# EasyEDA Pro project 硬件_幅度分档控制.epro

# Schematic Schematic1
Board Name: Board1; Create Date: 2025-05-23; Page Name: P1; Project Name: 硬件课设new; Schematic Name: Schematic1; Update Date: 2025-06-08; Company: 嘉立创EDA; Page Size: A4; Version: V1.0
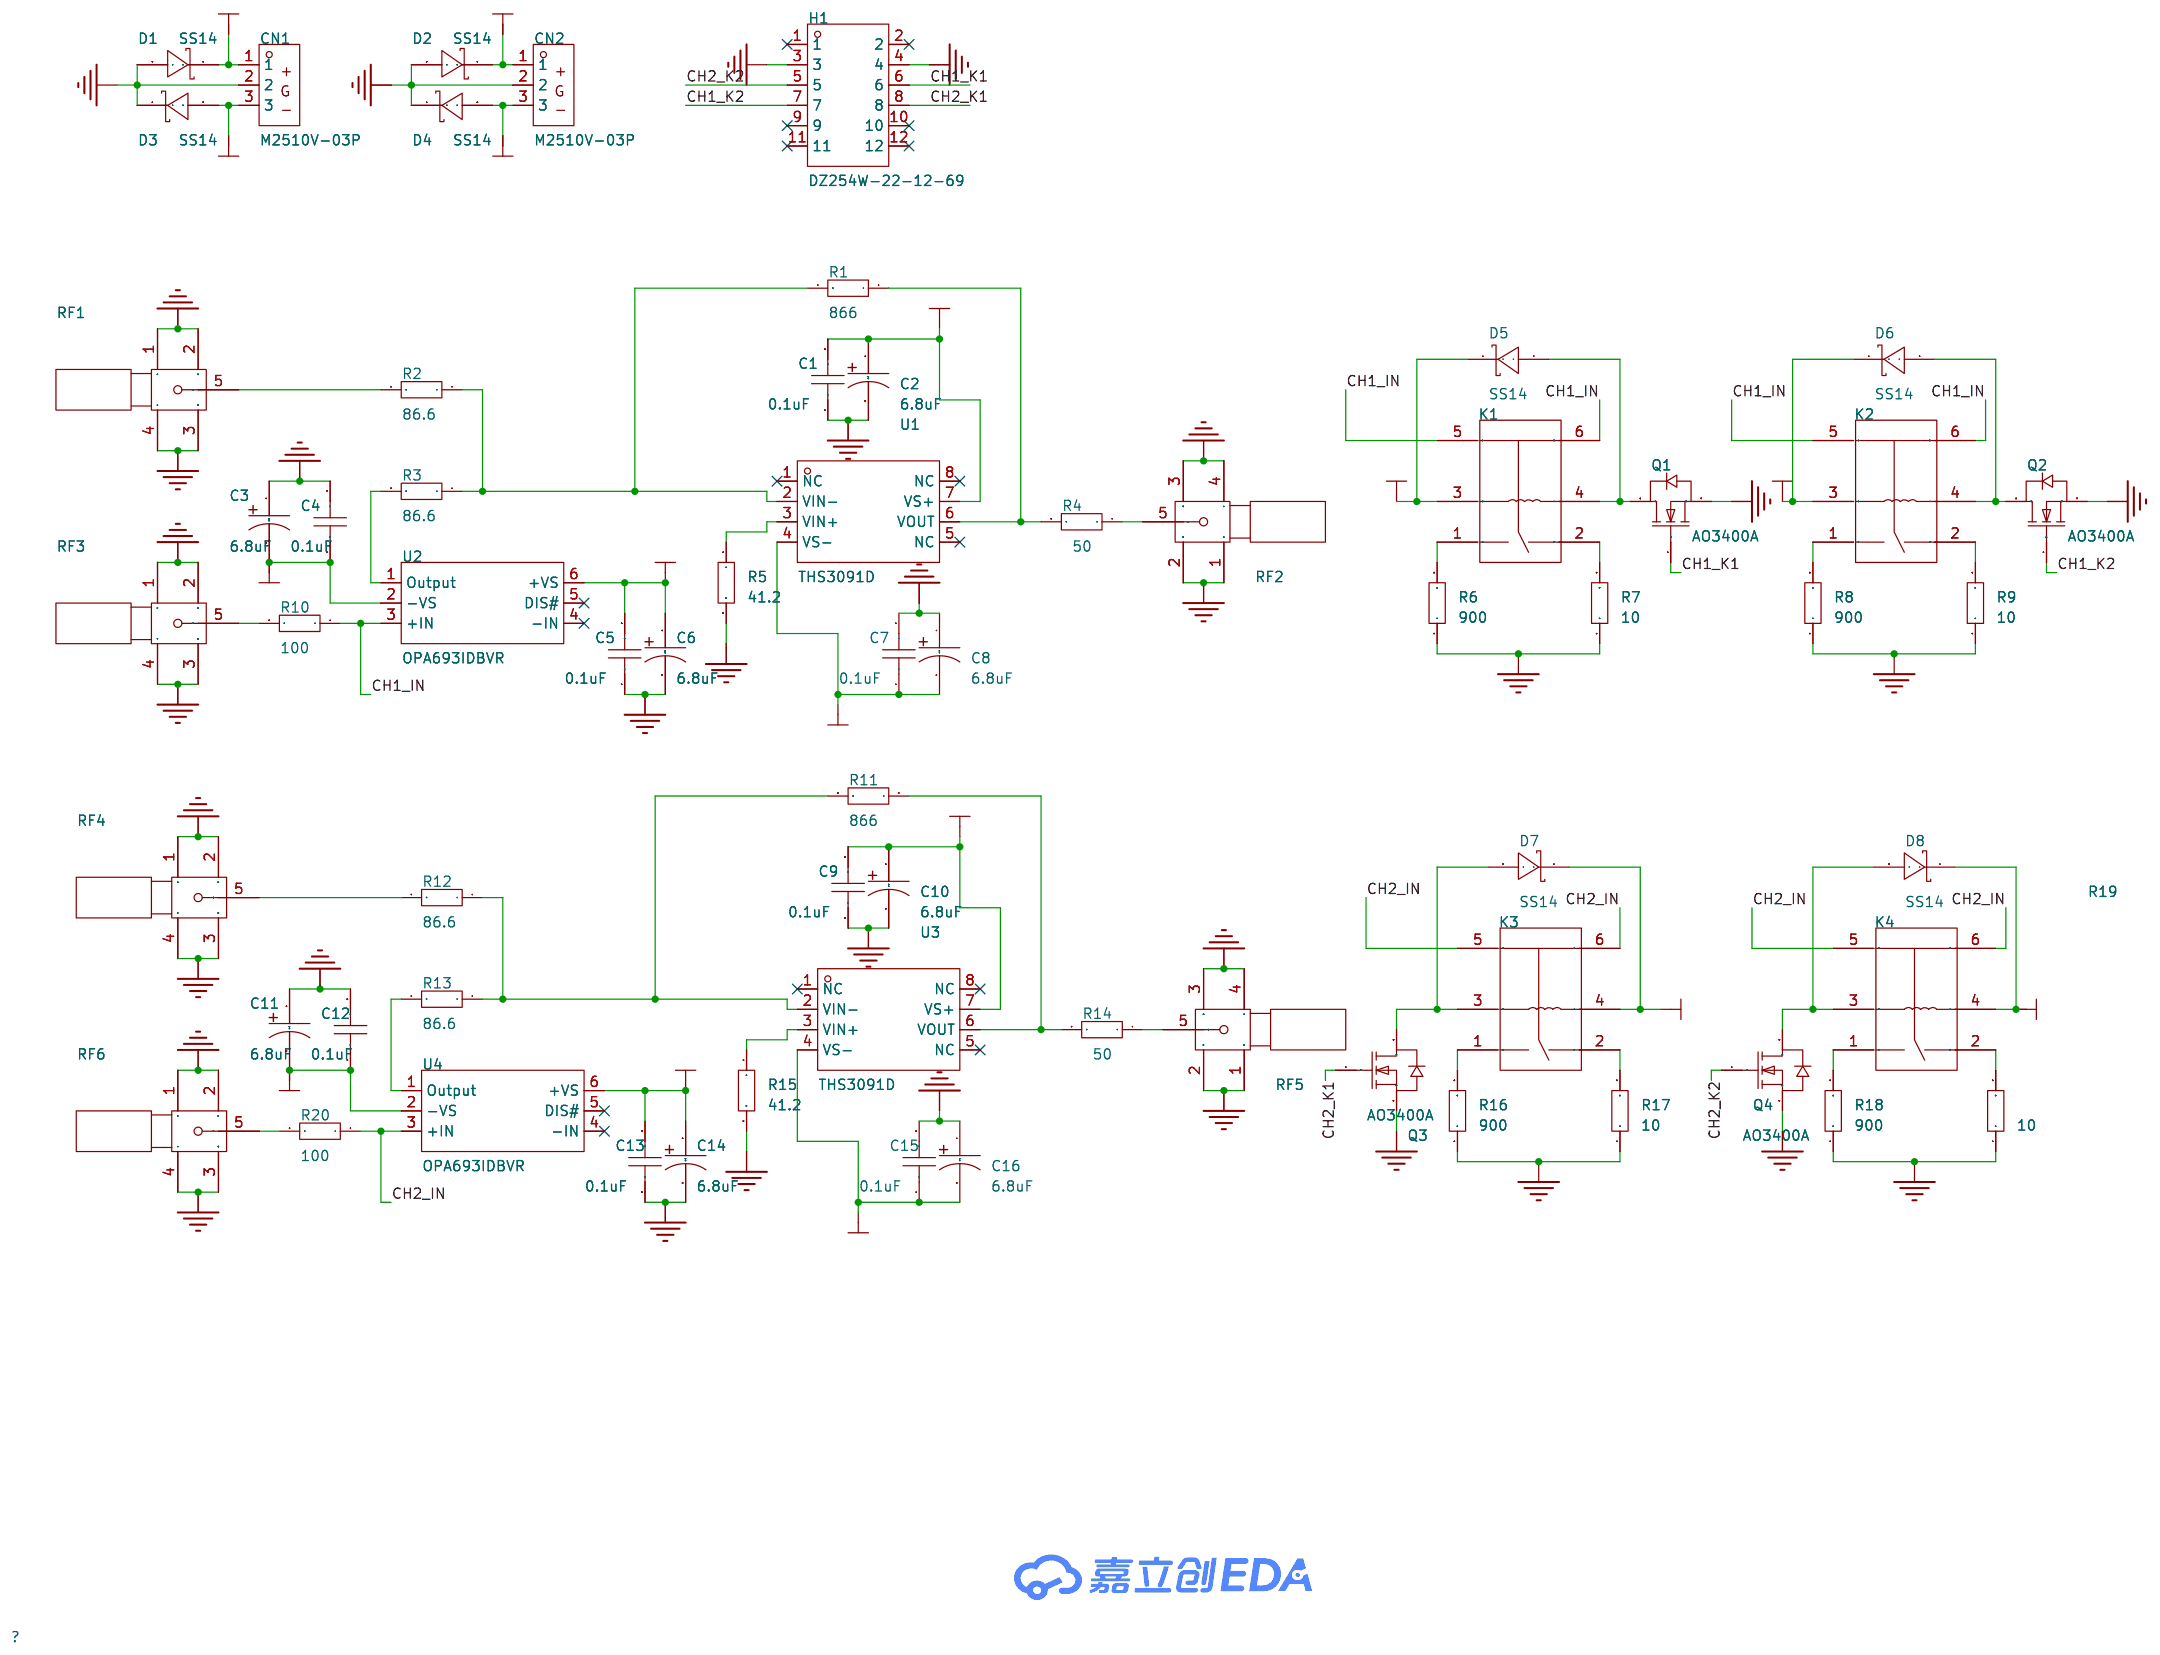
[diagram p0: schematic sheet]

## Parts
C1  0.1uF  [C0603_N]
C2  6.8uF  [CAP-SMD_L6.0-W3.2]
C3  6.8uF  [CAP-SMD_L6.0-W3.2]
C4  0.1uF  [C0603_N]
C5  0.1uF  [C0603_N]
C6  6.8uF  [CAP-SMD_L6.0-W3.2]
C7  0.1uF  [C0603_N]
C8  6.8uF  [CAP-SMD_L6.0-W3.2]
C9  0.1uF  [C0603_N]
C10  6.8uF  [CAP-SMD_L6.0-W3.2]
C11  6.8uF  [CAP-SMD_L6.0-W3.2]
C12  0.1uF  [C0603_N]
C13  0.1uF  [C0603_N]
C14  6.8uF  [CAP-SMD_L6.0-W3.2]
C15  0.1uF  [C0603_N]
C16  6.8uF  [CAP-SMD_L6.0-W3.2]
CN1  M2510V-03P  [CONN-TH_M2510V-03P]
CN2  M2510V-03P  [CONN-TH_M2510V-03P]
D1  SS14  [SMA_L4.3-W2.6-LS5.2-RD]
D2  SS14  [SMA_L4.3-W2.6-LS5.2-RD]
D3  SS14  [SMA_L4.3-W2.6-LS5.2-RD]
D4  SS14  [SMA_L4.3-W2.6-LS5.2-RD]
D5  SS14  [SMA_L4.3-W2.6-LS5.2-RD]
D6  SS14  [SMA_L4.3-W2.6-LS5.2-RD]
D7  SS14  [SMA_L4.3-W2.6-LS5.2-RD]
D8  SS14  [SMA_L4.3-W2.6-LS5.2-RD]
H1  DZ254W-22-12-69  [HDR-TH_12P-P2.54-H-M-R2-C6-S2.54-W12.5]
K1  HK4100F-DC5V-SHG  [RELAY-TH_HK4100F-DC5V-SHG]
K2  HK4100F-DC5V-SHG  [RELAY-TH_HK4100F-DC5V-SHG]
K3  HK4100F-DC5V-SHG  [RELAY-TH_HK4100F-DC5V-SHG]
K4  HK4100F-DC5V-SHG  [RELAY-TH_HK4100F-DC5V-SHG]
Q1  AO3400A  [SOT-23-3_L2.9-W1.3-P1.90-LS2.4-BR]
Q2  AO3400A  [SOT-23-3_L2.9-W1.3-P1.90-LS2.4-BR]
Q3  AO3400A  [SOT-23-3_L2.9-W1.3-P1.90-LS2.4-BR]
Q4  AO3400A  [SOT-23-3_L2.9-W1.3-P1.90-LS2.4-BR]
R1  866  [R0603_N]
R2  86.6  [R0603_N]
R3  86.6  [R0603_N]
R4  50  [R0603_N]
R5  41.2  [R0603_N]
R6  900  [R0603_N]
R7  10  [R0603_N]
R8  900  [R0603_N]
R9  10  [R0603_N]
R10  100  [R0603_N]
R11  866  [R0603_N]
R12  86.6  [R0603_N]
R13  86.6  [R0603_N]
R14  50  [R0603_N]
R15  41.2  [R0603_N]
R16  900  [R0603_N]
R17  10  [R0603_N]
R18  900  [R0603_N]
R19  10  [R0603_N]
R20  100  [R0603_N]
RF1  BWSMA-KE-P001  [SMA-SMD_BWSMA-KE-P001]
RF2  BWSMA-KE-P001  [SMA-SMD_BWSMA-KE-P001]
RF3  BWSMA-KE-P001  [SMA-SMD_BWSMA-KE-P001]
RF4  BWSMA-KE-P001  [SMA-SMD_BWSMA-KE-P001]
RF5  BWSMA-KE-P001  [SMA-SMD_BWSMA-KE-P001]
RF6  BWSMA-KE-P001  [SMA-SMD_BWSMA-KE-P001]
U1  THS3091D  [SOIC-8_L4.9-W3.9-P1.27-LS6.0-TR]
U2  OPA693IDBVR  [SOT-23-6_L2.9-W1.6-P0.95-LS2.8-BL]
U3  THS3091D  [SOIC-8_L4.9-W3.9-P1.27-LS6.0-TR]
U4  OPA693IDBVR  [SOT-23-6_L2.9-W1.6-P0.95-LS2.8-BL]

## Library data of the parts
C1 C4 C5 C7 C9 C12 C13 C15 = CAP_0805: Supplier Footprint: 0603
C2 C3 C6 C8 C10 C11 C14 C16 = TPSC685K035R0350: 容值:6.8uF;精度:±10%;额定电压:35V;等效串联电阻:350mΩ@100kHz;; LCSC Part Name: 6.8uF ±10% 35V; Supplier Part: C308928; Manufacturer: Kyocera AVX; Supplier Footprint: CASE-C-6032; JLCPCB Part Class: Extended Part; Datasheet: https://atta.szlcsc.com/upload/public/pdf/source/20181129/C308928_3E6DA6FC57C95F0966ACBCD944046350.pdf; Supplier: LCSC; Tolerance: ±10%; Rated Voltage: 35V; Equivalent Series Resistance(ESR): 350mΩ@100kHz; Operating Temperature: -55℃~+125℃
CN1 CN2 = M2510V-03P: 插针结构:1x3P;间距:2.54mm;安装方式:直插;参考系列:-;总PIN数:3P;排数:1;每排PIN数:3;行距:-;额定电流:3A;工作温度范围:-25℃~+85℃;; LCSC Part Name: 1x3P 间距:2.54mm 直插; Supplier Part: C2764791; Manufacturer: XFCN(兴飞); Supplier Footprint: 插件,P=2.54mm; JLCPCB Part Class: 扩展库; Datasheet: https://atta.szlcsc.com/upload/public/pdf/source/20210810/3DC46818253F58AEF0903D89F89BDDDF.pdf; Supplier: LCSC; Pins Structure: 1x3P; Pitch: 2.54mm; Mounting Style: 直插; Number of Pins: 3P; Number of Rows: 1; Number of PINs Per Row: 3; Current Rating (Max): 3A; Operating Temperature Range: -25℃~+85℃
D1-D8 = SS14_C83852: 正向压降(Vf):500mV@1A;直流反向耐压(Vr):40V;整流电流:1A;; LCSC Part Name: 电压:40V 电流:1A; Supplier Part: C83852; Manufacturer: onsemi(安森美); Supplier Footprint: SMA(DO-214AC); JLCPCB Part Class: 扩展库; Datasheet: https://atta.szlcsc.com/upload/public/pdf/source/20181222/C83852_041FE29A925F1DAA7D9CB1F1C69076C2.pdf; Supplier: LCSC; Forward Voltage (Vf@If): 500mV@1A; Reverse Voltage (Vr): 40V; Rectified Current: 1A; Reverse Leakage Current (Ir): 200uA@40V
H1 = DZ254W-22-12-69: 间距:2.54mm;总PIN位数:12;排数:2;插针结构:2x6P;行距:2.54mm;安装类型:弯插;圆针/方针:方针;额定电流:3A;额定电压:-;配合针长度:6mm;塑高:2.54mm;端接针长度:-;工作温度范围:-;颜色:-;; LCSC Part Name: 2.54mm 2x6P 弯插 方针; Supplier Part: C2935938; Manufacturer: DEALON(德艺隆); Supplier Footprint: 弯插,P=2.54mm; Datasheet: https://atta.szlcsc.com/upload/public/pdf/source/20211231/A9EB3FEFD92C329C455814A6A34A72A7.pdf; Supplier: LCSC; Pitch: 2.54mm; Number of Pins: 12; Number of Rows: 2; Pin Structure: 2x6P; Row Spacing: 2.54mm; Mounting Type: 弯插; Circluar Pins/Square Pins: 方针; Current Rating (Max): 3A; Length of Mating Pin: 6mm; Insulation Height: 2.54mm
K1-K4 = HK4100F-DC5V-SHG: 线圈电压:-;触点形式:-;触点容量(电阻负载):-;最大切换电压:-;最大切换电流:-;; Supplier Part: C12072; Manufacturer: 汇科; Supplier Footprint: DIP,10.5x14.5mm; JLCPCB Part Class: Extended Part; Datasheet: https://atta.szlcsc.com/upload/public/pdf/source/20180316/5A66D26635AF047552DED4727B242686.pdf; Supplier: LCSC
Q1-Q4 = AO3400A_C20917: 类型:1个N沟道;漏源电压(Vdss):30V;连续漏极电流(Id):5.7A;导通电阻(RDS(on)@Vgs,Id):26.5mΩ@10V,5.7A;功率(Pd):1.4W;阈值电压(Vgs(th)@Id):1.5V@250uA;; LCSC Part Name: 1个N沟道 耐压:30V 电流:5.7A; Supplier Part: C20917; Manufacturer: AOS; Supplier Footprint: SOT-23-3L; JLCPCB Part Class: 基础库; Datasheet: https://atta.szlcsc.com/upload/public/pdf/source/20140107/1457706668533.pdf; Supplier: LCSC; Type: 1个N沟道; Drain Source Voltage (Vdss): 30V; Continuous Drain Current (Id): 5.7A; Drain Source On Resistance (RDS(on)@Vgs,Id): 26.5mΩ@10V,5.7A; Power Dissipation (Pd): 1.4W; Gate Threshold Voltage (Vgs(th)@Id): 1.5V@250uA; Total Gate Charge (Qg@Vgs): 7nC@4.5V; Input Capacitance (Ciss@Vds): 630pF@15V; Operating Temperature: -55℃~+150℃@(Tj)
R1-R20 = Res_0603: Supplier Footprint: 0603
RF1-RF6 = BWSMA-KE-P001: 连接器类型:板端;接口类型:内孔;端口数量:1;接口直径:5.2mm;接口长度/高度:-;频率-最大值:-;射频系列:SMA;阻抗:50Ω;样式:偏脚;工作温度范围:-;; LCSC Part Name: 内孔 SMA 偏脚; Supplier Part: C496550; Manufacturer: BAT WIRELESS(蝙蝠无线); Supplier Footprint: SMD; JLCPCB Part Class: 扩展库; Datasheet: https://atta.szlcsc.com/upload/public/pdf/source/20240320/28FD502871C976DFF213ABFCF2A0ED51.pdf; Supplier: LCSC; Connector Type: 板端; Interface Type: 内孔; Number of Ports: 1; Interface Diameter: 5.2mm; RF Series: SMA; Impedance: 50Ω; Style: 偏脚
U1 U3 = THS3091D: 放大器数:单路;增益带宽积(GBP):-;输入偏置电流(Ib):4uA;压摆率(SR):7300V/us;带宽(-3db):235MHz;; Supplier Part: C2871031; Manufacturer: TI(德州仪器); Supplier Footprint: SOIC-8; JLCPCB Part Class: 扩展库; Datasheet: https://www.ti.com/cn/lit/gpn/ths3091; Supplier: LCSC; Number of Circuits: 单路; Current - Input Bias(Ib): 4uA; Slew Rate(SR): 7300V/us; Output Current: 280mA; -3db Bandwidth: 235MHz; Operating Temperature: -40℃~+85℃
U2 U4 = OPA693IDBVR: 放大器数:单路;带宽(-3db):1.4GHz;压摆率(SR):2500V/us;输入偏置电流(Ib):13mA;; Supplier Part: C2864664; Manufacturer: TI(德州仪器); Supplier Footprint: SOT-23-6; JLCPCB Part Class: 扩展库; Datasheet: https://www.ti.com/cn/lit/gpn/opa693; Supplier: LCSC; Number of Channels: 单路; -3dB Bandwidth: 1.4GHz; Slew Rate: 2500V/us; Voltage - Supply: 2.5V~6V; Ib - Input Bias Current: 13mA

## Nets
+5V: C5.2 C6.1 C13.2 C14.1 CN2.1 D2.1(K) D5.1(K) D6.1(K) D7.1(K) D8.1(K) K1.3 K2.3 K3.4 K4.4 U2.6(+VS) U4.6(+VS)
+12V: C1.2 C2.1 C9.2 C10.1 CN1.1 D1.1(K) U1.7(VS+) U3.7(VS+)
-5V: C3.2 C4.1 C11.2 C12.1 CN2.3 D4.2(A) U2.2(−VS) U4.2(−VS)
-12V: C7.1 C8.2 C15.1 C16.2 CN1.3 D3.2(A) U1.4(VS-) U3.4(VS-)
GND: C1.1 C2.2 C3.1 C4.2 C5.1 C6.2 C7.2 C8.1 C9.1 C10.2 C11.1 C12.2 C13.1 C14.2 C15.2 C16.1 CN1.2 CN2.2 D1.2(A) D2.2(A) D3.1(K) D4.1(K) H1.3 H1.4 Q1.2(S) Q2.2(S) Q3.2(S) Q4.2(S) R5.2 R6.1 R7.1 R8.1 R9.1 R15.2 R16.1 R17.1 R18.1 R19.1 RF1.1 RF1.2 RF1.3 RF1.4 RF2.1 RF2.2 RF2.3 RF2.4 RF3.1 RF3.2 RF3.3 RF3.4 RF4.1 RF4.2 RF4.3 RF4.4 RF5.1 RF5.2 RF5.3 RF5.4 RF6.1 RF6.2 RF6.3 RF6.4
CH1_IN: K1.5 K1.6 K2.5 K2.6 R10.1 U2.3(+IN)
CH1_K1: H1.6 Q1.1(G)
CH1_K2: H1.7 Q2.1(G)
CH2_IN: K3.5 K3.6 K4.5 K4.6 R20.1 U4.3(+IN)
CH2_K1: H1.8 Q3.1(G)
CH2_K2: H1.5 Q4.1(G)
$1N11526: K1.2 R7.2
$1N11529: K1.1 R6.2
$1N11532: D5.2(A) K1.4 Q1.3(D)
$1N13521: R2.2 RF1.5
$1N13584: R1.2 R2.1 R3.1 U1.2(VIN-)
$1N18532: R10.2 RF3.5
$1N18638: R3.2 U2.1(Output)
$1N18767: R5.1 U1.3(VIN+)
$1N19445: R4.1 RF2.5
$1N20863: K2.1 R8.2
$1N20868: D6.2(A) K2.4 Q2.3(D)
$1N20871: K2.2 R9.2
$1N24866: R1.1 R4.2 U1.6(VOUT)
$1N28278: D7.2(A) K3.3 Q3.3(D)
$1N28281: K3.1 R16.2
$1N28282: K3.2 R17.2
$1N28284: R12.2 RF4.5
$1N28285: R11.2 R12.1 R13.1 U3.2(VIN-)
$1N28293: R20.2 RF6.5
$1N28295: R13.2 U4.1(Output)
$1N28296: R15.1 U3.3(VIN+)
$1N28304: R14.1 RF5.5
$1N28314: K4.1 R18.2
$1N28315: K4.2 R19.2
$1N28319: R11.1 R14.2 U3.6(VOUT)
$1N30019: D8.2(A) K4.3 Q4.3(D)

Not connected (* = marked no-connect by the designer): H1 1* 2* 9* 10* 11* 12*; U1 1(NC)* 5(NC)* 8(NC)*; U2 4(−IN)* 5(DIS#)*; U3 1(NC)* 5(NC)* 8(NC)*; U4 4(−IN)* 5(DIS#)*

# Board PCB1
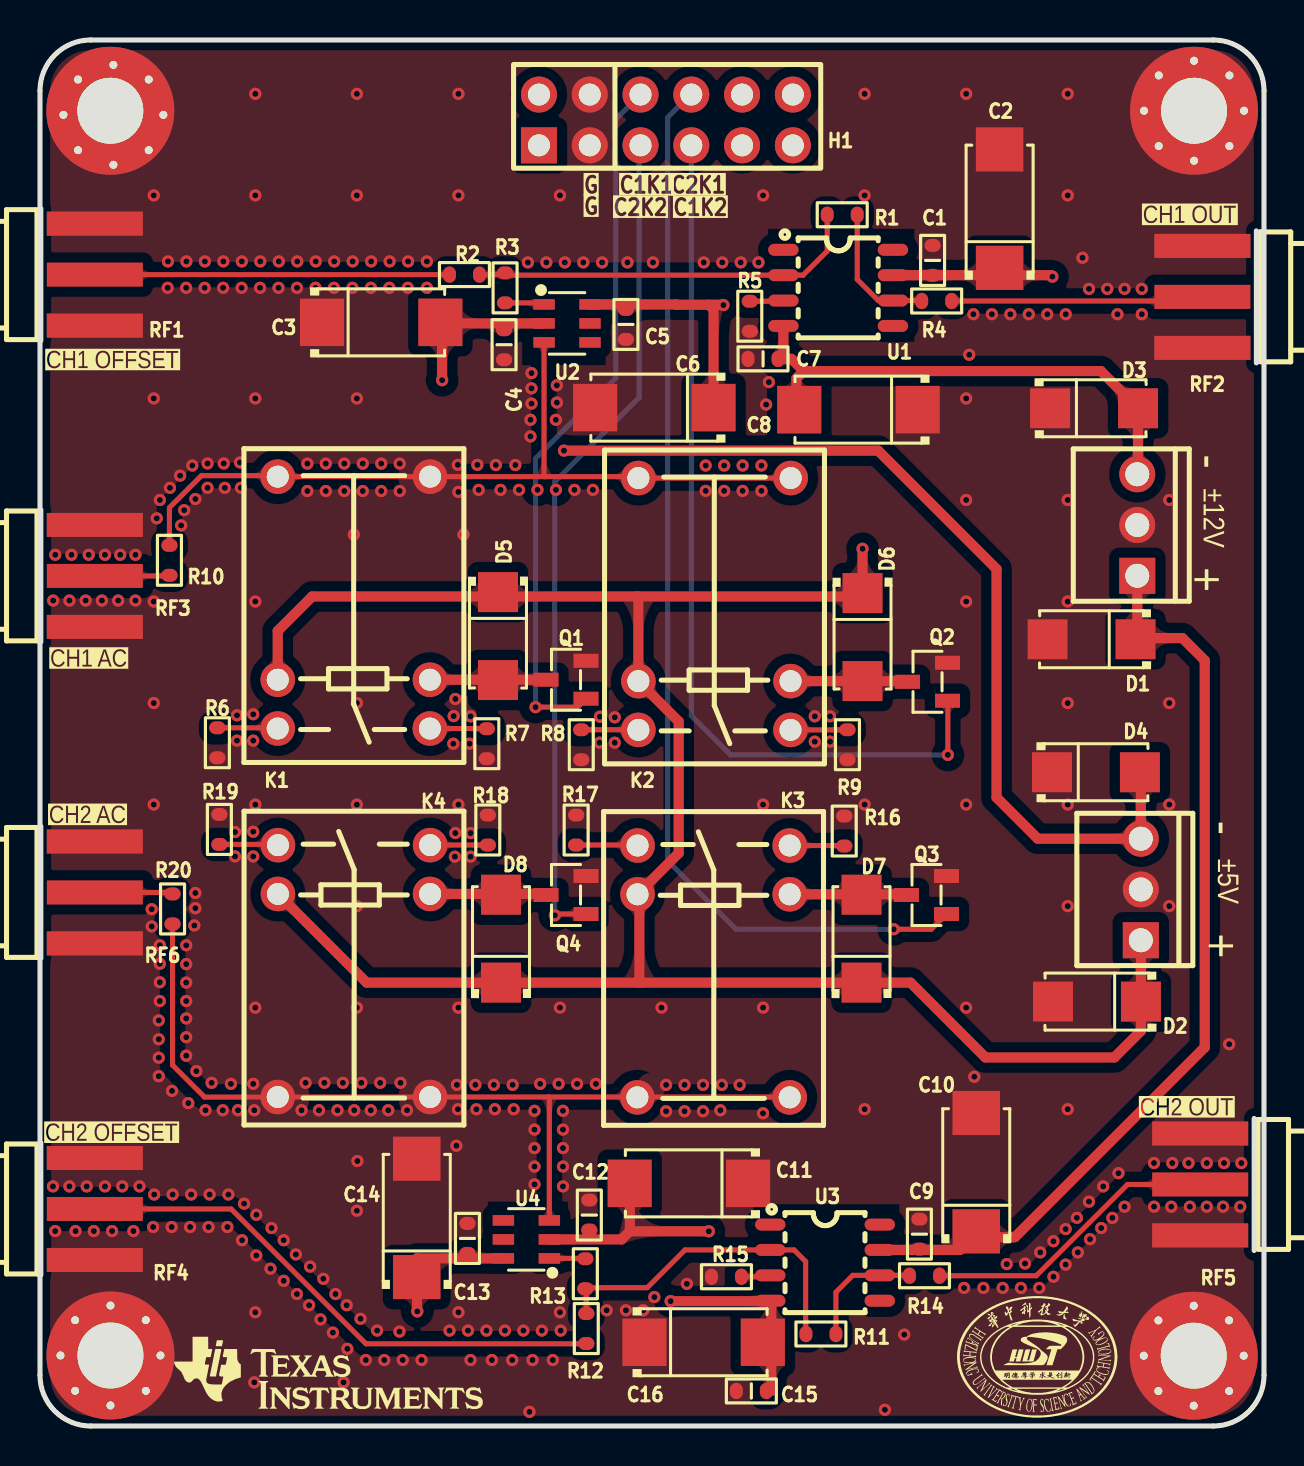
[diagram p1: board, top side]
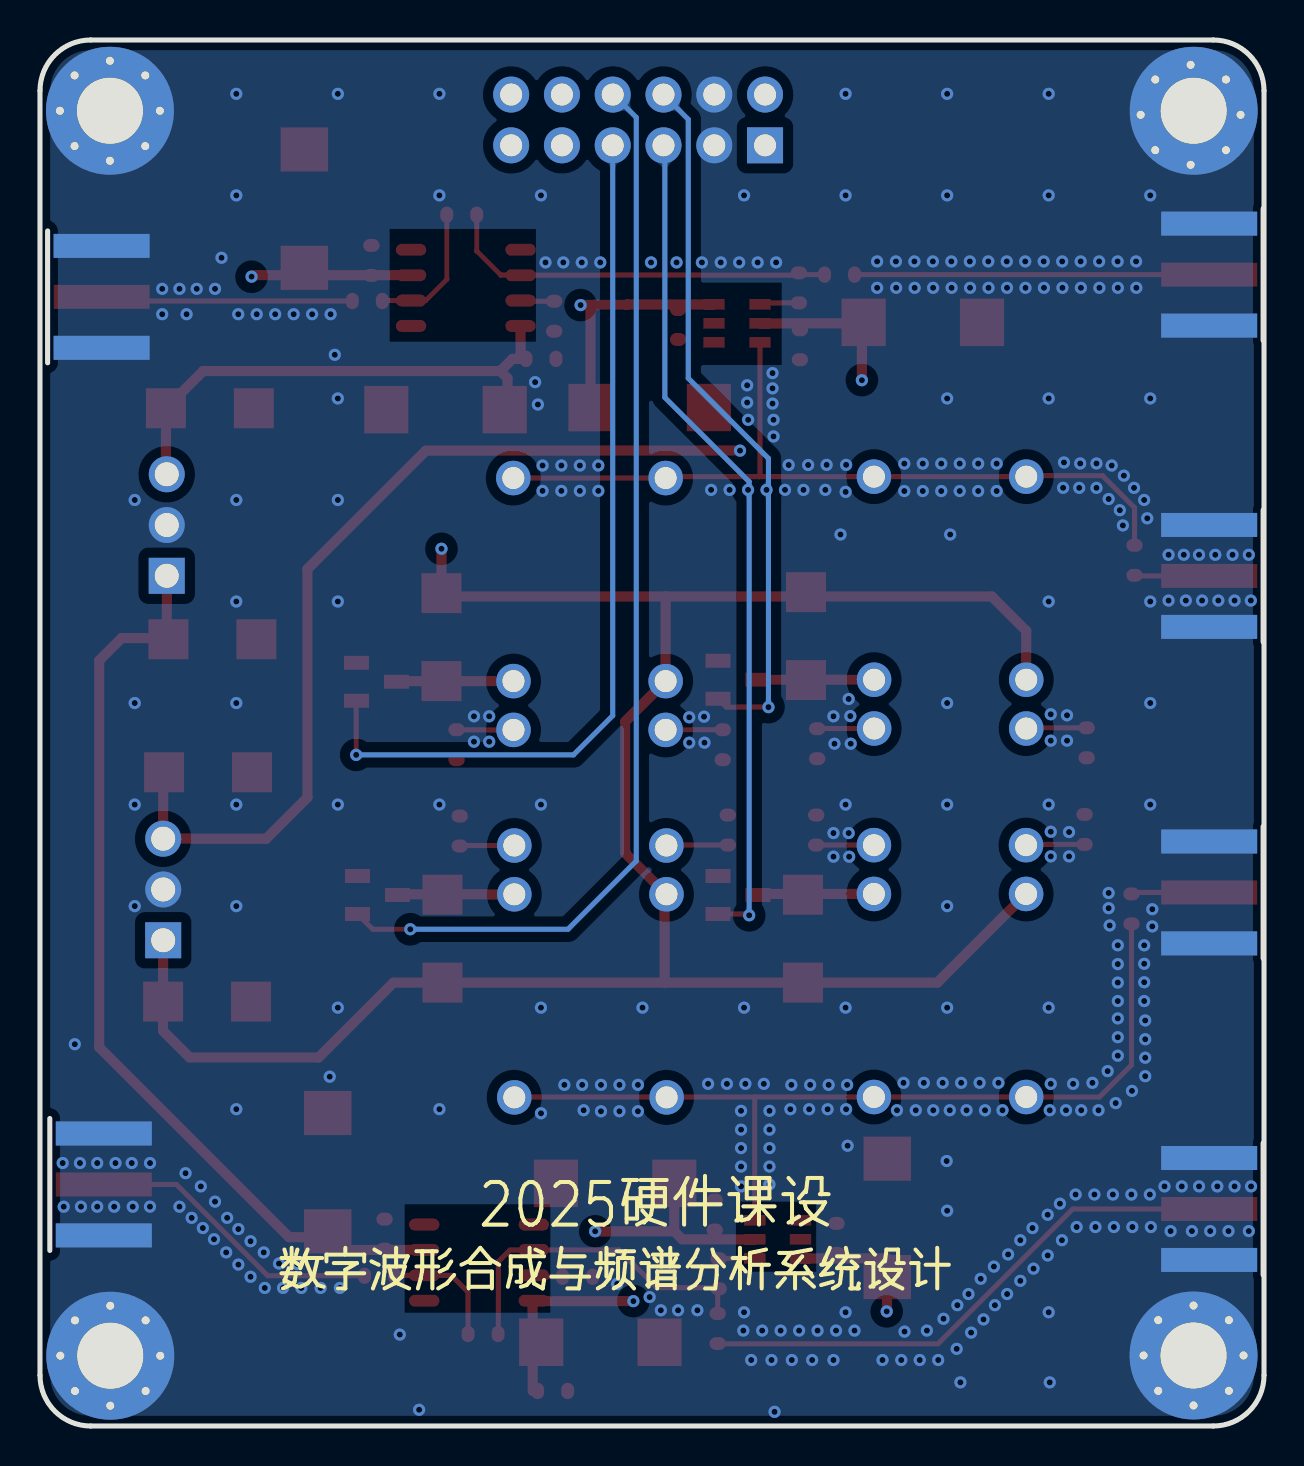
[diagram p2: board, bottom side, seen from below]

Outline 61.23 x 69.35 mm; copper layers: Top Layer, Inner1, Inner2, Bottom Layer. Coordinates in mm from the lower left corner of the outline.
Outline path: 0,66.81 0,2.54 arc(0.74,0.74) 2.54,0 58.69,0 arc(60.49,0.74) 61.23,2.54 61.23,66.81 arc(60.49,68.6) 58.69,69.35 2.54,69.35 arc(0.74,68.6) 0,66.81
Stack: Top Layer 0.035mm 外层铜厚1oz / Dielectric1 0.2104mm 7628 RC49% 8.6mil / Inner1 0.0152mm 内层铜厚 / Dielectric2 1.065mm 1.1mm H/HOZ Copper / Inner2 0.0152mm 内层铜厚 / Dielectric3 0.2104mm 7628 RC49% 8.6mil / Bottom Layer 0.035mm 外层铜厚1oz

## Design rules (mm)
template: 自定义配置
spacing copperThickness1oz (default): track to track 0.102, other pairs 0.152 to 0.3
spacing copperThickness2oz: track to track 0.203, other pairs 0.152 to 0.3
track width copperThickness1oz (default): min 0.127, default 0.254, max 2.54
track width copperThickness2oz: min 0.203, default 0.254, max 2.54
differential pair differentialPair (default): width min 0.127, default 0.254, max 2.54; gap min 0.152, default 0.152
via viaSize (default): diameter min 0.5, default 0.61, max 10; hole min 0.3, default 0.305, max 6.3
net GND uses power

## Placement (name value [footprint] x y rotation side)
C1  0.1uF  [C0603_N]  44.65 58.32 270 top
C2  6.8uF  [CAP-SMD_L6.0-W3.2]  48.01 60.91 90 top
C3  6.8uF  [CAP-SMD_L6.0-W3.2]  17.07 55.22 0 top
C4  0.1uF  [C0603_N]  23.22 54.1 270 top
C5  0.1uF  [C0603_N]  29.31 55.12 90 top
C6  6.8uF  [CAP-SMD_L6.0-W3.2]  30.73 50.95 180 top
C7  0.1uF  [C0603_N]  36.17 53.39 180 top
C8  6.8uF  [CAP-SMD_L6.0-W3.2]  40.94 50.85 180 top
C9  0.1uF  [C0603_N]  43.99 9.6 270 top
C10  6.8uF  [CAP-SMD_L6.0-W3.2]  46.84 12.7 90 top
C11  6.8uF  [CAP-SMD_L6.0-W3.2]  32.46 12.14 180 top
C12  0.1uF  [C0603_N]  27.48 10.56 90 top
C13  0.1uF  [C0603_N]  21.38 9.39 270 top
C14  6.8uF  [CAP-SMD_L6.0-W3.2]  18.85 10.41 90 top
C15  0.1uF  [C0603_N]  35.59 1.75 180 top
C16  6.8uF  [CAP-SMD_L6.0-W3.2]  33.2 4.19 0 top
CN1  M2510V-03P  [CONN-TH_M2510V-03P]  54.89 45.08 270 top
CN2  M2510V-03P  [CONN-TH_M2510V-03P]  55.07 26.84 270 top
D1  SS14  [SMA_L4.3-W2.6-LS5.2-RD]  52.6 39.36 180 top
D2  SS14  [SMA_L4.3-W2.6-LS5.2-RD]  52.88 21.23 180 top
D3  SS14  [SMA_L4.3-W2.6-LS5.2-RD]  52.73 50.92 0 top
D4  SS14  [SMA_L4.3-W2.6-LS5.2-RD]  52.82 32.71 0 top
D5  SS14  [SMA_L4.3-W2.6-LS5.2-RD]  22.91 39.52 270 top
D6  SS14  [SMA_L4.3-W2.6-LS5.2-RD]  41.15 39.47 270 top
D7  SS14  [SMA_L4.3-W2.6-LS5.2-RD]  41.1 24.38 90 top
D8  SS14  [SMA_L4.3-W2.6-LS5.2-RD]  23.06 24.38 90 top
H1  DZ254W-22-12-69  [HDR-TH_12P-P2.54-H-M-R2-C6-S2.54-W12.5]  31.31 65.35 180 top
K1  HK4100F-DC5V-SHG  [RELAY-TH_HK4100F-DC5V-SHG]  15.7 41.2 90 top
K2  HK4100F-DC5V-SHG  [RELAY-TH_HK4100F-DC5V-SHG]  33.74 41.13 90 top
K3  HK4100F-DC5V-SHG  [RELAY-TH_HK4100F-DC5V-SHG]  33.69 22.74 270 top
K4  HK4100F-DC5V-SHG  [RELAY-TH_HK4100F-DC5V-SHG]  15.71 22.76 270 top
NOREF  -  [Pad_e484]  59.5 64.04 0 top
NOREF#2  -  [Pad_e477]  60.23 65.81 0 top
NOREF#3  -  [Pad_e482]  55.97 64.04 0 top
NOREF#4  -  [Pad_e718]  55.95 1.75 0 top
NOREF#5  -  [Pad_e709]  1.76 1.76 0 top
NOREF#6  -  [Pad_e717]  55.22 3.52 0 top
NOREF#7  -  [Pad_e464]  3.52 65.81 0 top
NOREF#8  -  [Pad_e476]  57.73 65.81 0 top
NOREF#9  -  [Pad_e480]  55.97 67.57 0 top
NOREF#10  -  [Pad_e479]  57.73 68.31 0 top
NOREF#11  -  [Pad_e474]  1.9 67.37 0 top
NOREF#12  -  [Pad_e703]  3.53 3.53 0 top
NOREF#13  -  [Pad_e468]  3.67 68.1 0 top
NOREF#14  -  [Pad_e466]  6.17 65.6 0 top
NOREF#15  -  [Pad_e470]  3.67 63.1 0 top
NOREF#16  -  [Pad_e706]  3.53 6.03 0 top
NOREF#17  -  [Pad_e472]  1.17 65.6 0 top
NOREF#18  -  [Pad_e481]  55.23 65.81 0 top
NOREF#19  -  [Pad_e720]  59.48 1.75 0 top
NOREF#20  -  [Pad_e705]  5.29 5.3 0 top
NOREF#21  -  [Pad_e711]  5.29 1.76 0 top
NOREF#22  -  [Pad_e719]  57.72 1.02 0 top
NOREF#23  -  [Pad_e708]  1.03 3.53 0 top
NOREF#24  -  [Pad_e478]  59.5 67.57 0 top
NOREF#25  -  [Pad_e483]  57.73 63.31 0 top
NOREF#26  -  [Pad_e704]  6.03 3.53 0 top
NOREF#27  -  [Pad_e713]  60.22 3.52 0 top
NOREF#28  -  [Pad_e471]  5.44 63.83 0 top
NOREF#29  -  [Pad_e716]  55.95 5.29 0 top
NOREF#30  -  [Pad_e715]  57.72 6.02 0 top
NOREF#31  -  [Pad_e714]  59.48 5.29 0 top
NOREF#32  -  [Pad_e707]  1.76 5.3 0 top
NOREF#33  -  [Pad_e710]  3.53 1.03 0 top
NOREF#34  -  [Pad_e473]  1.9 63.83 0 top
NOREF#35  -  [Pad_e469]  5.44 67.37 0 top
NOREF#36  -  [Pad_e712]  57.72 3.52 0 top
Q1  AO3400A  [SOT-23-3_L2.9-W1.3-P1.90-LS2.4-BR]  26.31 37.34 0 top
Q2  AO3400A  [SOT-23-3_L2.9-W1.3-P1.90-LS2.4-BR]  44.4 37.24 0 top
Q3  AO3400A  [SOT-23-3_L2.9-W1.3-P1.90-LS2.4-BR]  44.35 26.57 0 top
Q4  AO3400A  [SOT-23-3_L2.9-W1.3-P1.90-LS2.4-BR]  26.31 26.57 0 top
R1  866  [R0603_N]  40.13 60.6 180 top
R2  86.6  [R0603_N]  21.23 57.61 180 top
R3  86.6  [R0603_N]  23.27 56.94 270 top
R4  50  [R0603_N]  44.86 56.29 180 top
R5  41.2  [R0603_N]  35.51 55.52 270 top
R6  900  [R0603_N]  8.87 34.18 90 top
R7  10  [R0603_N]  22.35 34.14 90 top
R8  900  [R0603_N]  27.08 34.09 90 top
R9  10  [R0603_N]  40.39 34.09 90 top
R10  100  [R0603_N]  6.48 43.31 270 top
R11  866  [R0603_N]  39.07 4.6 180 top
R12  86.6  [R0603_N]  27.33 4.88 270 top
R13  86.6  [R0603_N]  27.28 7.62 90 top
R14  50  [R0603_N]  44.25 7.52 180 top
R15  41.2  [R0603_N]  34.34 7.47 180 top
R16  900  [R0603_N]  40.23 29.77 270 top
R17  10  [R0603_N]  26.82 29.82 270 top
R18  900  [R0603_N]  22.4 29.82 270 top
R19  10  [R0603_N]  8.98 29.85 270 top
R20  100  [R0603_N]  6.63 25.87 90 top
RF1  BWSMA-KE-P001  [SMA-SMD_BWSMA-KE-P001]  2.74 57.61 180 top
RF2  BWSMA-KE-P001  [SMA-SMD_BWSMA-KE-P001]  58.15 56.49 0 top
RF3  BWSMA-KE-P001  [SMA-SMD_BWSMA-KE-P001]  2.74 42.53 180 top
RF4  BWSMA-KE-P001  [SMA-SMD_BWSMA-KE-P001]  2.74 10.86 180 top
RF5  BWSMA-KE-P001  [SMA-SMD_BWSMA-KE-P001]  58.04 12.09 0 top
RF6  BWSMA-KE-P001  [SMA-SMD_BWSMA-KE-P001]  2.74 26.7 180 top
U1  THS3091D  [SOIC-8_L4.9-W3.9-P1.27-LS6.0-TR]  39.93 56.94 90 top
U2  OPA693IDBVR  [SOT-23-6_L2.9-W1.6-P0.95-LS2.8-BL]  26.37 55.17 270 top
U3  THS3091D  [SOIC-8_L4.9-W3.9-P1.27-LS6.0-TR]  39.27 8.17 90 top
U4  OPA693IDBVR  [SOT-23-6_L2.9-W1.6-P0.95-LS2.8-BL]  24.33 9.34 90 top

## Footprints (pads in the part's own frame, mm; a bottom-side part is the same pattern mirrored in y, then rotated)
C0603_N
  rrect 0.65x0.82 smd: 1(-0.75,0) 2(0.75,0)
CAP-SMD_L6.0-W3.2
  rect 2.208x2.376 smd: 1(-2.962,0) 2(2.962,0)
CONN-TH_M2510V-03P
  rect 1.8x1.8 hole 1.2: 1(2.54,0)
  round 1.8 hole 1.2: 2(0,0) 3(-2.54,0)
HDR-TH_12P-P2.54-H-M-R2-C6-S2.54-W12.5
  rect 1.801x1.801 hole 1.1: 1(6.35,1.27)
  round 1.801 hole 1.1: 2(6.35,-1.27) 3(3.81,1.27) 4(3.81,-1.27) 5(1.27,1.27) 6(1.27,-1.27) 7(-1.27,1.27) 8(-1.27,-1.27) 9(-3.81,1.27) 10(-3.81,-1.27) 11(-6.35,1.27) 12(-6.35,-1.27)
Pad_e464
  round 6.4 hole 3.3: 1(0,0)
Pad_e466
  round 0.8 hole 0.4: 1(0,0)
Pad_e468
  round 0.8 hole 0.4: 1(0,0)
Pad_e469
  round 0.8 hole 0.4: 1(0,0)
Pad_e470
  round 0.8 hole 0.4: 1(0,0)
Pad_e471
  round 0.8 hole 0.4: 1(0,0)
Pad_e472
  round 0.8 hole 0.4: 1(0,0)
Pad_e473
  round 0.8 hole 0.4: 1(0,0)
Pad_e474
  round 0.8 hole 0.4: 1(0,0)
Pad_e476
  round 6.4 hole 3.3: 1(0,0)
Pad_e477
  round 0.8 hole 0.4: 1(0,0)
Pad_e478
  round 0.8 hole 0.4: 1(0,0)
Pad_e479
  round 0.8 hole 0.4: 1(0,0)
Pad_e480
  round 0.8 hole 0.4: 1(0,0)
Pad_e481
  round 0.8 hole 0.4: 1(0,0)
Pad_e482
  round 0.8 hole 0.4: 1(0,0)
Pad_e483
  round 0.8 hole 0.4: 1(0,0)
Pad_e484
  round 0.8 hole 0.4: 1(0,0)
Pad_e703
  round 6.4 hole 3.3: 1(0,0)
Pad_e704
  round 0.8 hole 0.4: 1(0,0)
Pad_e705
  round 0.8 hole 0.4: 1(0,0)
Pad_e706
  round 0.8 hole 0.4: 1(0,0)
Pad_e707
  round 0.8 hole 0.4: 1(0,0)
Pad_e708
  round 0.8 hole 0.4: 1(0,0)
Pad_e709
  round 0.8 hole 0.4: 1(0,0)
Pad_e710
  round 0.8 hole 0.4: 1(0,0)
Pad_e711
  round 0.8 hole 0.4: 1(0,0)
Pad_e712
  round 6.4 hole 3.3: 1(0,0)
Pad_e713
  round 0.8 hole 0.4: 1(0,0)
Pad_e714
  round 0.8 hole 0.4: 1(0,0)
Pad_e715
  round 0.8 hole 0.4: 1(0,0)
Pad_e716
  round 0.8 hole 0.4: 1(0,0)
Pad_e717
  round 0.8 hole 0.4: 1(0,0)
Pad_e718
  round 0.8 hole 0.4: 1(0,0)
Pad_e719
  round 0.8 hole 0.4: 1(0,0)
Pad_e720
  round 0.8 hole 0.4: 1(0,0)
R0603_N
  rrect 0.65x0.82 smd: 1(-0.75,0) 2(0.75,0)
RELAY-TH_HK4100F-DC5V-SHG
  round 1.727 hole 1.1: 1(-6.301,3.81) 2(-6.301,-3.8) 3(-3.86,3.81) 4(-3.86,-3.803) 5(6.301,3.81) 6(6.301,-3.81)
SMA-SMD_BWSMA-KE-P001
  rect 4.8x1.2 smd: 1(0,-2.55) 2(0,2.55) 5(0,0)
  rect 4.8x1.2 smd far side: 3(0,2.55) 4(0,-2.55)
SMA_L4.3-W2.6-LS5.2-RD
  rect 2x2 smd: 1(-2.2,0) 2(2.2,0)
SOIC-8_L4.9-W3.9-P1.27-LS6.0-TR
  oval 0.6x1.52 smd: 1(1.905,2.74) 2(0.635,2.74) 3(-0.635,2.74) 4(-1.905,2.74) 5(-1.905,-2.74) 6(-0.635,-2.74) 7(0.635,-2.74) 8(1.905,-2.74)
SOT-23-3_L2.9-W1.3-P1.90-LS2.4-BR
  rect 1.25x0.7 smd: 1(1,-0.95) 2(1,0.95) 3(-1,0)
SOT-23-6_L2.9-W1.6-P0.95-LS2.8-BL
  rect 0.532x1.072 smd: 1(-0.95,-1.149) 2(0,-1.149) 3(0.95,-1.149) 4(0.95,1.149) 5(0,1.149) 6(-0.95,1.149)

## Nets
As in the schematic, except:
GND: C1.1 C2.2 C3.1 C4.2 C5.1 C6.2 C7.2 C8.1 C9.1 C10.2 C11.1 C12.2 C13.1 C14.2 C15.2 C16.1 CN1.2 CN2.2 D1.2 D2.2 D3.1 D4.1 H1.3 H1.4 NOREF.1 NOREF#2.1 NOREF#3.1 NOREF#4.1 NOREF#5.1 NOREF#6.1 NOREF#7.1 NOREF#8.1 NOREF#9.1 NOREF#10.1 NOREF#11.1 NOREF#12.1 NOREF#13.1 NOREF#14.1 NOREF#15.1 NOREF#16.1 NOREF#17.1 NOREF#18.1 NOREF#19.1 NOREF#20.1 NOREF#21.1 NOREF#22.1 NOREF#23.1 NOREF#24.1 NOREF#25.1 NOREF#26.1 NOREF#27.1 NOREF#28.1 NOREF#29.1 NOREF#30.1 NOREF#31.1 NOREF#32.1 NOREF#33.1 NOREF#34.1 NOREF#35.1 NOREF#36.1 Q1.2 Q2.2 Q3.2 Q4.2 R5.2 R6.1 R7.1 R8.1 R9.1 R15.2 R16.1 R17.1 R18.1 R19.1 RF1.1 RF1.2 RF1.3 RF1.4 RF2.1 RF2.2 RF2.3 RF2.4 RF3.1 RF3.2 RF3.3 RF3.4 RF4.1 RF4.2 RF4.3 RF4.4 RF5.1 RF5.2 RF5.3 RF5.4 RF6.1 RF6.2 RF6.3 RF6.4

Pads without a net: H1 1 2 9 10 11 12; U1 1 5 8; U2 4 5; U3 1 5 8; U4 4 5

## Via types
v1: diameter 0.61, hole 0.305, Top Layer to Bottom Layer, 396 vias

## Routing (per net, layer and track width the routed paths; a pad name or vN(x,y) marks a point on that pad's centre or on a via; arc(x,y) is an arc through that point)
+5V: length 197.7
  Top Layer w0.508: 33.45,56.1 34.17,56.1 v1(34.19,56.08) ; 33.45,56.1 33.7,55.86 C6.1 ; 33.45,56.1 31.85,56.1 31.84,56.12 U2.6 ; 29.98,22.18 29.98,26.51 K3.4 31.95,28.66 31.95,35.25 K2.3 29.93,41.46 29.89,41.5 ; 29.98,22.18 D8.1 16.34,22.18 11.9,26.62 ; 29.98,22.18 D7.1 43.55,22.18 47.29,18.44 53.75,18.44 55.07,19.77 D2.1 55.07,24.3 CN2.1 ; 29.89,41.5 40.98,41.5 D6.1 ; 29.89,41.5 13.61,41.5 11.89,39.78 11.89,37.24 ; 18.86,8.39 U4.6 ; 18.86,8.39 18.84,8.37 ; 18.86,8.39 18.86,5.75 v1(18.88,5.74) ; 41.05,41.96 41.15,42.06 v1(41.15,43.89)
  Inner2 w0.508: v1(34.19,56.08) 41.15,49.12 v1(41.15,43.89) ; v1(18.88,5.74) 18.88,4.8 21.95,1.73 47.35,1.73 55.02,9.4 55.02,24.25 CN2.1
+12V: length 73.6
  Top Layer w0.508: 42.01,8.81 46.02,8.81 46.66,9.45 48.77,9.45 58.27,18.95 58.27,38.3 57.15,39.42 54.86,39.42 D1.1 ; 54.86,39.67 54.89,39.7 CN1.1 ; v1(50.65,57.51) 50.57,57.58 U1.7
  Inner2 w0.508: v1(50.65,57.51) 57.61,50.55 57.61,45.25 CN1.1
-5V: length 104.4
  Top Layer w0.508: U2.2 20.71,55.17 20.12,54.58 v1(20.12,52.32) ; 29.5,9.74 29.5,12.14 C11.2 ; 29.5,9.74 29.1,9.34 U4.2 ; 29.5,9.74 v1(33.46,9.74) ; D4.2 55.07,32.67 CN2.3 49.91,29.38 47.85,31.44 47.85,42.88 41.93,48.8 v1(26.21,48.8)
  Inner2 w0.508: v1(26.21,48.8) 20.24,48.8 20.12,48.92 v1(20.12,52.32) ; CN2.3 53.1,29.38 v1(33.46,9.74)
-12V: length 87.2
  Top Layer w0.508: 37.19,55.04 37.19,53.66 C7.1 37.59,53.39 38.2,52.78 ; 54.51,47.6 54.71,47.8 ; v1(31.55,6.25) 36.51,6.25 36.53,6.27 36.59,6.21 36.59,1.75 ; 38.2,52.78 53.07,52.78 D3.2 54.93,47.66 54.89,47.62 ; 38.2,52.78 37.84,52.42 37.84,50.99 C8.2
  Inner2 w0.508: v1(31.55,6.25) 31.5,6.3 31.5,12.23 48.62,29.35 48.62,41.34 54.89,47.62
GND:
  vias: v1(0.65,11.99) v1(0.66,41.3) v1(0.76,43.59) v1(0.76,9.75) v1(1.47,41.3) v1(1.47,11.99) v1(1.58,43.59) v1(1.78,9.75) v1(2.29,41.3) v1(2.34,11.99) v1(2.44,43.59) v1(2.69,9.75) v1(3.1,41.3) v1(3.25,43.59) v1(3.25,11.99) v1(3.61,9.75) v1(3.91,41.3) v1(4.01,43.59) v1(4.11,11.99) v1(4.67,9.75) v1(4.78,43.59) v1(4.78,41.3) v1(4.98,11.99) v1(5.59,25.86) v1(5.59,25) v1(5.69,61.57) v1(5.69,51.41) v1(5.69,41.25) v1(5.69,36.17) v1(5.69,31.09) v1(5.71,11.58) v1(5.66,9.96) v1(5.84,45.42) v1(5.94,20.29) v1(5.94,19.35) v1(5.94,18.43) v1(5.94,17.5) v1(6,46.33) v1(5.99,24.05) v1(5.99,23.13) v1(5.99,22.2) v1(5.99,21.26) v1(6.4,58.27) v1(6.39,56.95) v1(6.5,46.94) v1(6.61,16.77) v1(6.64,11.58) v1(6.59,9.96) v1(7.01,47.55) v1(7.06,45.06) v1(7.21,45.82) v1(7.33,58.27) v1(7.31,56.95) v1(7.31,24.05) v1(7.31,23.11) v1(7.31,22.19) v1(7.31,21.26) v1(7.31,20.39) v1(7.31,19.45) v1(7.31,18.53) v1(7.42,16.16) v1(7.51,9.96) v1(7.62,48.06) v1(7.56,11.58) v1(7.72,25.04) v1(7.77,46.38) v1(7.77,26.67) v1(7.77,25.91) v1(7.82,17.76) v1(8.25,58.27) v1(8.24,56.95) v1(8.28,15.8) v1(8.38,48.16) v1(8.38,46.94) v1(8.43,9.96) v1(8.49,11.58) v1(8.59,17.17) v1(9.14,15.8) v1(9.17,58.27) v1(9.16,56.95) v1(9.19,48.16) v1(9.25,46.94) v1(9.43,11.58) v1(9.38,9.96) v1(9.55,17.12) v1(9.75,29.72) v1(9.75,28.5) v1(9.85,35.56) v1(9.85,34.29) v1(9.91,15.8) v1(10.01,48.21) v1(10.1,58.27) v1(10.09,56.95) v1(10.05,46.94) v1(10.11,9.3) v1(10.21,11.12) v1(10.67,35.61) v1(10.67,34.29) v1(10.67,29.73) v1(10.67,28.5) v1(10.67,17.12) v1(10.72,15.8) v1(10.72,2.18) v1(10.77,66.65) v1(10.77,61.57) v1(10.77,51.41) v1(10.77,41.25) v1(10.77,31.09) v1(10.77,20.93) v1(10.82,10.57) v1(10.82,8.53) v1(10.77,5.69) v1(11.02,58.27) v1(11.01,56.95) v1(11.53,7.87) v1(11.58,9.91) v1(11.95,58.27) v1(11.93,56.95) v1(12.19,9.3) v1(12.19,7.26) v1(12.8,8.59) v1(12.87,58.27) v1(12.86,56.95) v1(12.85,6.6) v1(13.08,15.8) v1(13.29,17.17) v1(13.37,48.15) v1(13.37,46.78) v1(13.51,7.98) v1(13.46,6.04) v1(13.79,58.27) v1(13.78,56.95) v1(13.96,15.8) v1(14.03,5.33) v1(14.23,17.17) v1(14.17,7.37) v1(14.3,48.15) v1(14.3,46.78) v1(14.72,58.27) v1(14.71,56.95) v1(14.65,4.67) v1(14.78,6.6) v1(14.88,15.8) v1(15.22,48.15) v1(15.22,46.78) v1(15.15,17.17) v1(15.19,2.18) v1(15.34,6.04) v1(15.37,3.86) v1(15.64,58.27) v1(15.63,56.95) v1(15.7,44.61) v1(15.72,15.8) v1(15.85,66.65) v1(15.85,61.57) v1(15.85,51.41) v1(15.85,36.17) v1(15.85,31.09) v1(15.85,26.01) v1(15.85,20.93) v1(15.88,13.26) v1(15.85,10.77) v1(16.03,5.37) v1(16.15,48.15) v1(16.15,46.78) v1(16.08,17.17) v1(16.3,3.3) v1(16.55,15.8) v1(16.57,58.27) v1(16.55,56.95) v1(16.87,4.78) v1(17.02,17.17) v1(17.07,48.15) v1(17.07,46.78) v1(17.22,3.3) v1(17.42,15.8) v1(17.49,58.27) v1(17.48,56.95) v1(18,48.15) v1(18,46.78) v1(18.03,17.17) v1(17.98,4.72) v1(18.15,3.3) v1(18.41,58.27) v1(18.4,56.95) v1(18.36,15.8) v1(19.09,3.3) v1(19.35,58.27) v1(19.35,56.95) v1(20.49,4.78) v1(20.69,35.52) v1(20.68,34.14) v1(20.78,36.38) v1(20.78,29.67) v1(20.75,28.48) v1(20.83,14.02) v1(20.93,66.65) v1(20.93,61.57) v1(20.91,48.09) v1(20.93,46.74) v1(20.93,31.09) v1(20.93,20.93) v1(20.86,17.07) v1(20.91,15.85) v1(20.93,5.69) v1(21.19,44.61) v1(21.41,4.78) v1(21.54,35.51) v1(21.49,34.14) v1(21.54,29.67) v1(21.54,28.49) v1(21.54,3.3) v1(21.78,17.07) v1(21.83,15.85) v1(21.88,48.09) v1(21.95,46.84) v1(22.33,4.78) v1(22.61,3.3) v1(22.7,17.07) v1(22.8,48.08) v1(22.75,15.85) v1(23.04,46.84) v1(23.26,4.78) v1(23.65,17.07) v1(23.62,3.3) v1(23.7,15.85) v1(23.78,48.08) v1(23.96,46.84) v1(24.18,4.78) v1(24.41,58.22) v1(24.54,50.34) v1(24.54,49.51) v1(24.49,0.71) v1(24.59,52.68) v1(24.59,51.92) v1(24.59,51.16) v1(24.64,3.3) v1(24.74,15.77) v1(24.74,14.83) v1(24.74,13.91) v1(24.74,12.98) v1(24.74,12.09) v1(25.02,17.12) v1(25.11,4.78) v1(25.33,58.22) v1(25.65,3.3) v1(25.81,50.34) v1(25.86,52.07) v1(25.86,51.21) v1(25.95,17.12) v1(26.01,61.57) v1(26.01,20.93) v1(26.01,5.69) v1(26.05,4.78) v1(26.16,15.77) v1(26.16,14.83) v1(26.16,13.91) v1(26.16,12.98) v1(26.16,11.99) v1(26.25,58.22) v1(26.74,46.84) v1(26.87,17.12) v1(27.18,58.22) v1(27.66,46.84) v1(27.81,17.12) v1(28.01,35.49) v1(27.99,34.19) v1(28.12,58.22) v1(28.35,5.79) v1(28.75,35.46) v1(28.75,34.19) v1(29.31,5.79) v1(29.39,58.22) v1(30.18,5.79) v1(30.67,58.22) v1(30.73,6.45) v1(31.09,20.93) v1(31.32,17.07) v1(31.32,15.75) v1(32.25,17.07) v1(32.25,15.75) v1(32.36,7.11) v1(33.21,58.22) v1(33.17,17.07) v1(33.17,15.75) v1(33.3,48.06) v1(33.3,46.79) v1(34.04,15.8) v1(34.13,58.22) v1(34.11,17.07) v1(34.23,48.06) v1(34.23,46.79) v1(35,17.07) v1(35.05,58.22) v1(35.15,48.06) v1(35.15,46.79) v1(35.94,58.22) v1(36.09,48.06) v1(36.09,46.79) v1(36.17,61.57) v1(36.17,31.09) v1(36.17,20.93) v1(36.17,15.65) v1(36.32,51.11) v1(36.46,52.23) v1(38.76,35.51) v1(38.76,34.24) v1(39.52,35.51) v1(39.52,34.24) v1(41.25,66.65) v1(41.25,61.57) v1(41.25,31.09) v1(41.25,15.85) v1(42.27,0.81) v1(43.23,4.57) v1(46.23,6.91) v1(46.33,66.65) v1(46.33,51.41) v1(46.33,46.33) v1(46.33,41.25) v1(46.33,31.09) v1(46.33,20.93) v1(46.48,53.6) v1(46.69,55.63) v1(46.74,17.48) v1(47.19,6.91) v1(47.62,55.63) v1(48.16,6.91) v1(48.36,8.1) v1(48.54,55.63) v1(49.07,6.91) v1(49.28,8.13) v1(49.47,55.63) v1(50.04,8.69) v1(49.99,6.91) v1(50.39,55.63) v1(50.7,9.25) v1(50.7,7.47) v1(51.31,55.63) v1(51.31,9.85) v1(51.31,8.08) v1(51.41,66.65) v1(51.41,61.57) v1(51.41,46.33) v1(51.41,41.25) v1(51.41,36.17) v1(51.41,31.09) v1(51.41,26.01) v1(51.41,15.85) v1(51.87,10.42) v1(51.92,8.69) v1(52.15,58.45) v1(52.48,56.9) v1(52.48,11.23) v1(52.53,9.35) v1(53.09,9.91) v1(53.19,11.99) v1(53.39,56.9) v1(53.65,10.41) v1(53.9,55.63) v1(53.95,12.65) v1(54.25,56.9) v1(54.25,10.97) v1(55.12,56.9) v1(55.12,55.63) v1(55.73,13.16) v1(55.73,10.98) v1(56.49,46.33) v1(56.49,36.17) v1(56.49,31.09) v1(56.49,26.01) v1(56.64,13.16) v1(56.59,10.97) v1(57.46,13.16) v1(57.52,10.97) v1(58.37,13.16) v1(58.37,10.97) v1(59.23,13.16) v1(59.18,10.97) v1(59.49,19.1) v1(60.05,10.97) v1(60.1,13.16)
CH1_IN: length 40.4
  Top Layer w0.254: R10.1 6.48,45.95 8.08,47.55 11.84,47.55 K1.5 K1.6 25.25,47.5 ; 25.25,47.5 29.87,47.5 K2.5 K2.6 ; 25.25,47.5 25.22,47.53 U2.3
CH1_K1: length 35.5
  Top Layer w0.254: v1(24.79,35.97) 26.89,35.97 Q1.1
  Bottom Layer w0.254: H1.6 28.8,65.38 28.8,52.43 24.79,48.41 v1(24.79,35.97)
  vias: v1(24.89,46.84)
CH1_K2: length 44.9
  Top Layer w0.254: v1(45.41,33.58) 45.41,36.27 Q2.1
  Bottom Layer w0.254: H1.7 32.58,35.54 34.54,33.58 v1(45.41,33.58)
CH2_IN: length 44.8
  Top Layer w0.254: R20.1 6.63,18.06 8.23,16.46 11.89,16.46 11.9,16.46 25.44,16.46 ; 25.44,16.46 37.49,16.46 K3.5 ; 25.44,16.46 25.48,16.42 U4.3
CH2_K1: length 54.5
  Top Layer w0.254: v1(42.71,24.86) 44.59,24.86 Q3.1
  Bottom Layer w0.254: H1.8 32.55,66.62 31.4,65.47 31.4,28.27 34.82,24.86 v1(42.71,24.86)
CH2_K2: length 42.1
  Top Layer w0.254: Q4.1 25.82,25.62 v1(25.76,25.55)
  Bottom Layer w0.254: v1(25.76,25.55) 25.76,47.24 29.97,51.46 29.97,63.38 29.28,64.08
  vias: v1(25.81,46.84)
$1N11526: length 2.9
  Top Layer w0.254: R7.2 22.34,34.9 K1.2
$1N11529: length 3
  Top Layer w0.254: K1.1 11.86,34.93 R6.2
$1N11532: length 5.8
  Top Layer w0.508: 19.51,37.34 Q1.3
$1N13521: length 17.7
  Top Layer w0.254: RF1.5 R2.2
$1N13584: length 19.7
  Top Layer w0.254: 23.33,57.58 38.17,57.58 39.38,58.79 R1.2 ; 23.27,57.64 23.23,57.61 R2.1
$1N18532: length 3.7
  Top Layer w0.254: RF3.5 6.45,42.53 R10.2
$1N18638: length 2
  Top Layer w0.254: U2.1 25.14,56.19 R3.2
$1N18767: length 1.7
  Top Layer w0.254: R5.1 37.15,56.27 37.19,56.31
$1N19445: length 12.6
  Top Layer w0.254: RF2.5 57.94,56.29 R4.1
$1N20863: length 2.9
  Top Layer w0.254: R8.2 29.93,34.84 K2.1
$1N20868: length 5.9
  Top Layer w0.508: Q2.3 43.37,37.27 K2.4
$1N20871: length 2.9
  Top Layer w0.254: R9.2 40.38,34.83 K2.2
$1N24866: length 6.9
  Top Layer w0.254: R4.2 44.08,56.31 41.94,56.31 40.88,57.36 R1.1
$1N28278: length 5.9
  Top Layer w0.508: Q3.3 43.31,26.6 K3.3
$1N28281: length 2.7
  Top Layer w0.254: R16.2 40.21,29.04 K3.1
$1N28282: length 3.1
  Top Layer w0.254: R17.2 29.87,29.07 K3.2
$1N28284: length 27.4
  Top Layer w0.254: RF4.5 9.56,10.86 16.31,4.12 27.32,4.12 R12.2
$1N28285: length 17
  Top Layer w0.254: R12.1 27.33,6.82 R13.1 27.33,6.92 30.38,6.92 32.27,8.81 37.72,8.81 38.3,8.23 38.3,4.62 R11.2
$1N28293: length 3.9
  Top Layer w0.254: RF6.5 6.56,26.7 R20.2
$1N28295: length 1.8
  Top Layer w0.254: R13.2 27.26,8.39 U4.1
$1N28296: length 1.5
  Top Layer w0.254: R15.1 36.46,7.47 U3.3
$1N28304: length 14.9
  Top Layer w0.254: RF5.5 54.4,12.09 49.84,7.52 R14.1
$1N28314: length 2.9
  Top Layer w0.254: R18.2 19.52,29.07 K4.1
$1N28315: length 2.9
  Top Layer w0.254: K4.2 11.87,29.1 R19.2
$1N28319: length 6.1
  Top Layer w0.254: R11.1 39.82,6.69 40.66,7.54 U3.6 43.48,7.54 R14.2
$1N30019: length 5.8
  Top Layer w0.508: 19.52,26.62 25.26,26.62 Q4.3

## Copper pours and planes (outline as drawn; the poured copper is in the pictures)
GND on Top Layer: -8.64,74.27 67.77,74.27 67.77,-2.9 -8.64,-2.9
GND on Bottom Layer: -9.65,71.68 69.7,71.68 69.7,-1.73 -9.65,-1.73
GND on Inner1: -12.7,78.08 72.39,78.08 72.39,-6.91 -12.7,-6.91

Small or netless copper shapes (teardrops, artwork), in the pictures only: 172 on Top Layer, 12 on Bottom Layer, 12 on Inner2

## Text on the board
Bottom Silkscreen Layer: 数字波形合成与频谱分析系统设计 | 2025硬件课设
Top Silkscreen Layer: G | C2K2 | C1K1 | C2K1 | C1K2 | CH2 OFFSET | CH1 OFFSET | CH2 AC | CH1 AC | CH2 OUT | CH1 OUT | ±12V | ±5V | + | -
